# EAGLE design Camera (EAGLE 9.6.2)
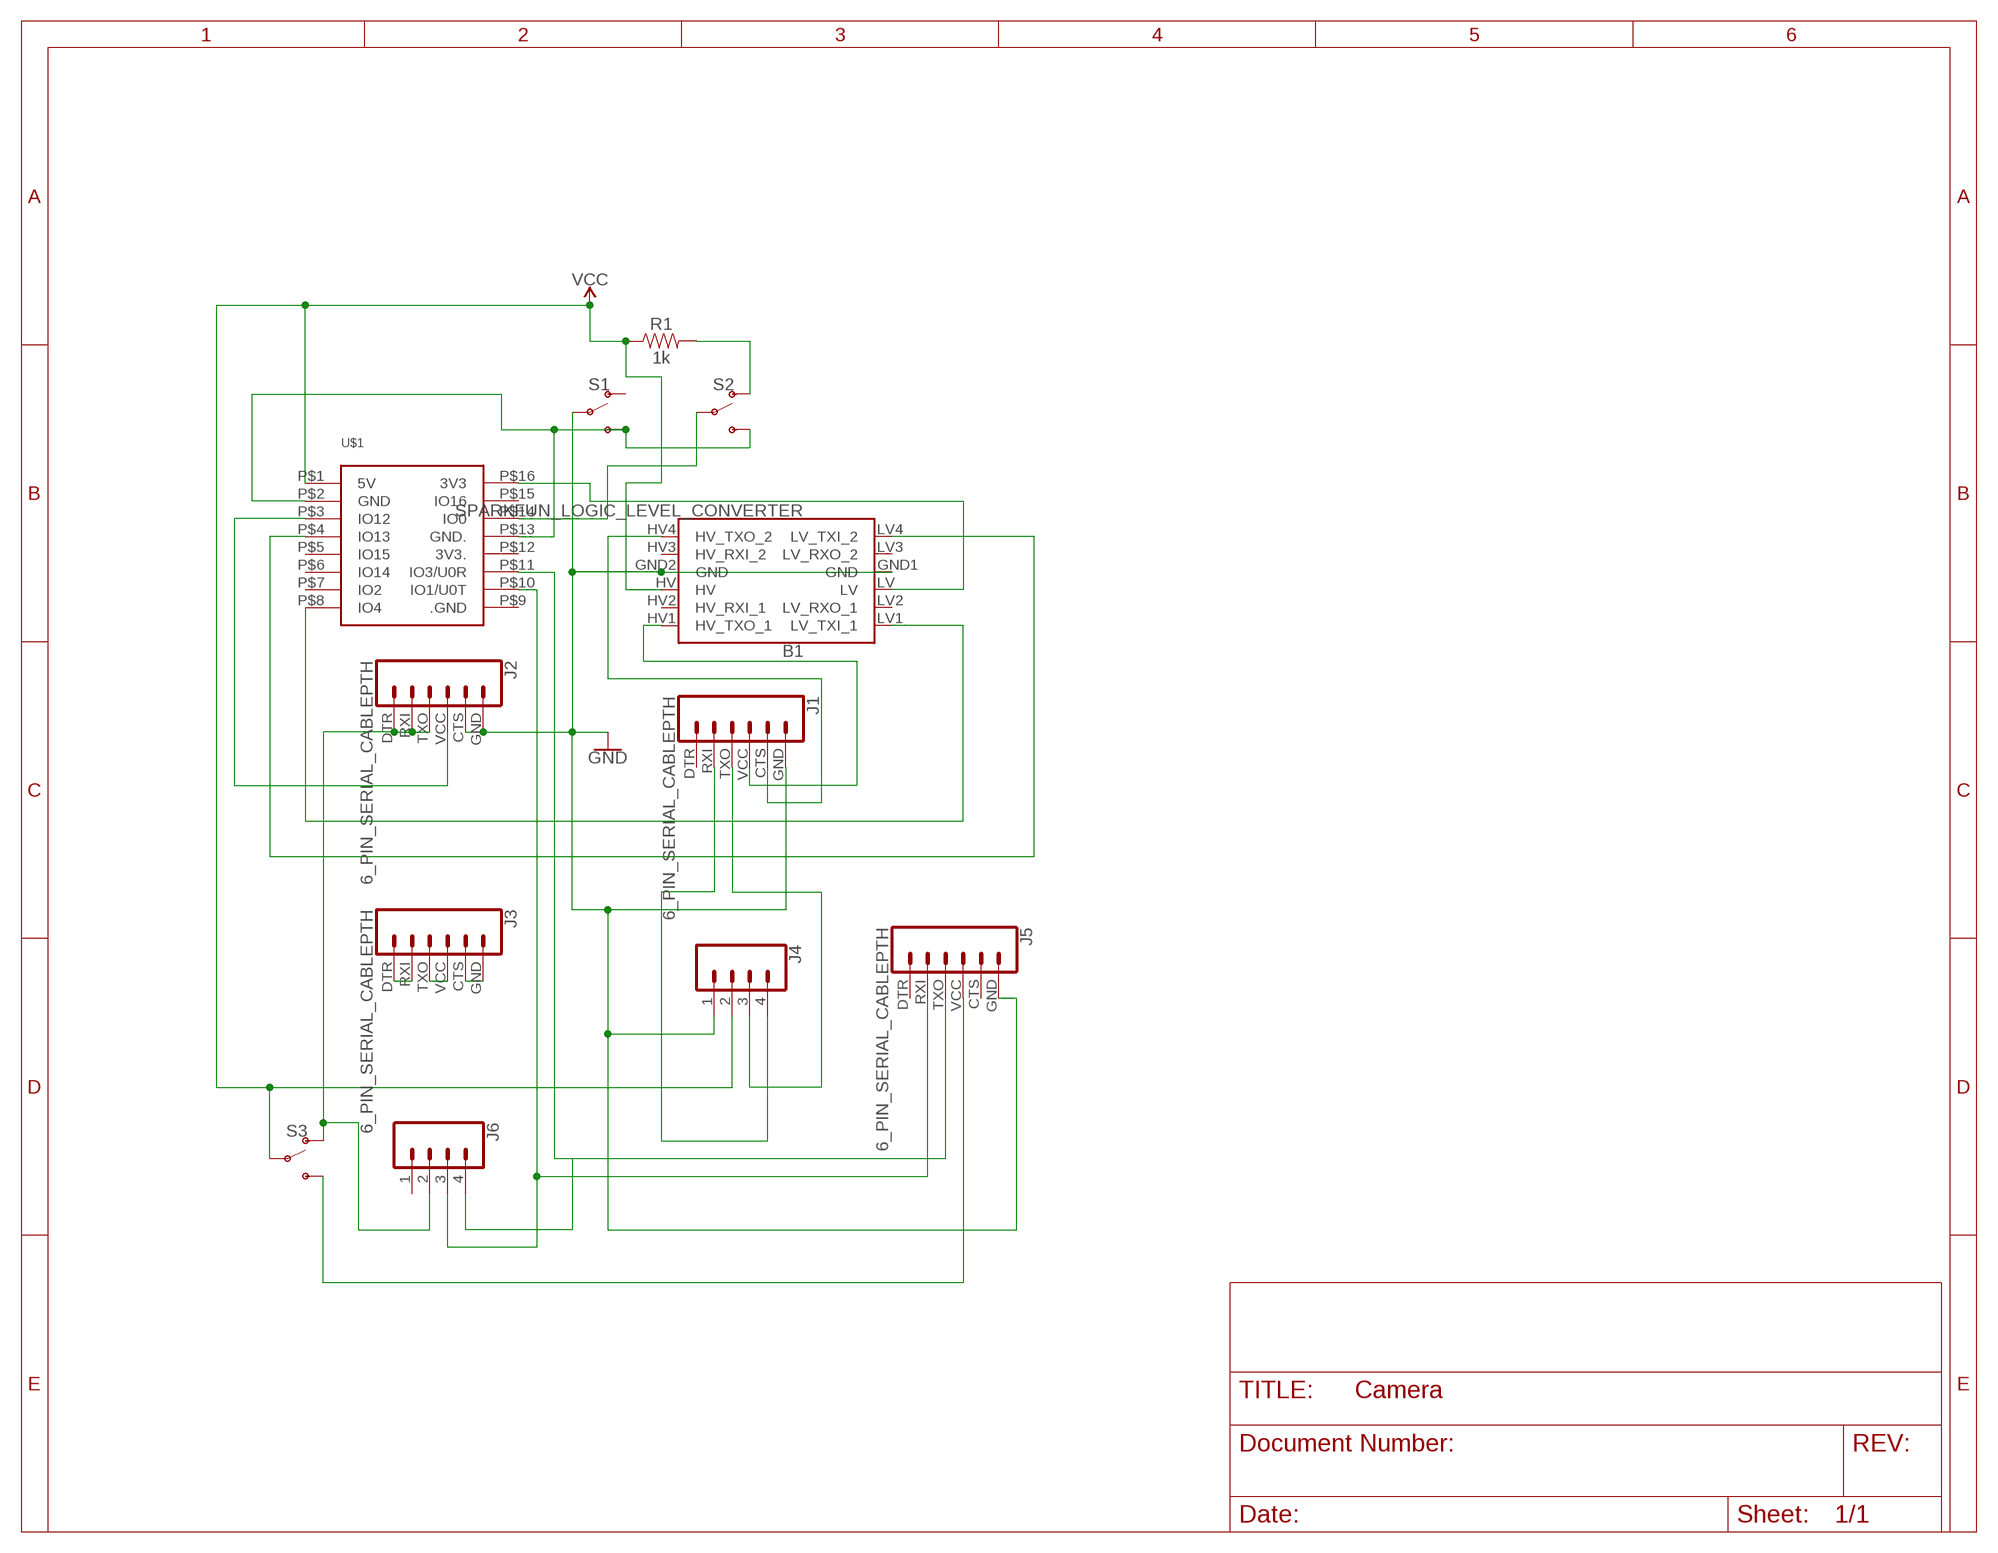
[diagram p0: schematic, sheet 1]

## Parts
B1  SPARKFUN_LOGIC_LEVEL_CONVERTER  [SPARKFUN_LOGIC_LEVEL_CONVERTER]
J1  6_PIN_SERIAL_CABLEPTH  [FTDI_BASIC]
J2  6_PIN_SERIAL_CABLEPTH  [FTDI_BASIC]
J3  6_PIN_SERIAL_CABLEPTH  [FTDI_BASIC]
J4  CONN_04PTH  [1X04]
J5  6_PIN_SERIAL_CABLEPTH  [FTDI_BASIC]
J6  CONN_04PTH  [1X04]
R1  1k  1KOHM-HORIZ_KIT-1/4W-1%  [AXIAL-0.3-KIT]
S1  SWITCH-SPDT-PTH-11.6X4.0MM  [SWITCH_SPDT_PTH_11.6X4.0MM]
S2  SWITCH-SPDT-PTH-11.6X4.0MM  [SWITCH_SPDT_PTH_11.6X4.0MM]
S3  SWITCH-SPDT-PTH-11.6X4.0MM  [SWITCH_SPDT_PTH_11.6X4.0MM]
U$1  ESP32-CAM  [ESP32-CAM]

## Nets
GND: B1.GND1(GND) B1.GND2(GND) J1.GND J2.CTS J2.GND J4.1 J5.GND S1.2(P)
N$1: R1.P$2 S2.1(O)
N$2: S1.3(S) S2.3(S) U$1.P$2(GND) U$1.P$13(GND.)
N$3: J3.DTR J3.RXI
N$4: S2.2(P) U$1.P$14(IO0)
N$5: J3.TXO J3.VCC
N$6: B1.LV1(LV_TXI_1) U$1.P$8(IO4)
N$7: B1.LV4(LV_TXI_2) U$1.P$4(IO13)
N$8: J3.CTS J3.GND
N$9: J2.VCC U$1.P$3(IO12)
N$10: B1.HV1(HV_TXO_1) J1.VCC
N$11: B1.HV4(HV_TXO_2) J1.CTS
N$12: J1.RXI J4.4
N$13: J1.TXO J4.3
N$14: B1.LV U$1.P$16(3V3)
N$15: J5.TXO J6.4 U$1.P$11(IO3/U0R)
N$16: J5.RXI J6.3 U$1.P$10(IO1/U0T)
N$17: J2.DTR J2.RXI J2.TXO J6.2 S3.1(O)
N$18: J5.VCC S3.3(S)
VCC: B1.HV J4.2 R1.P$1 S3.2(P) U$1.P$1(5V)
Unconnected: B1.HV2(HV_RXI_1) B1.HV3(HV_RXI_2) B1.LV2(LV_RXO_1) B1.LV3(LV_RXO_2) J1.DTR J5.CTS J5.DTR J6.1 S1.1(O) U$1.P$5(IO15) U$1.P$6(IO14) U$1.P$7(IO2) U$1.P$9(.GND) U$1.P$12(3V3.) U$1.P$15(IO16)

## Library data of the parts
B1 = SparkFun-Boards:SPARKFUN_LOGIC_LEVEL_CONVERTER: SparkFun Logic Level Converter -Bi-Directional This is the mechnical outline for the 3.3V - 5V bi directional logic level converter. *Note, the "LOCK" Package has the header pins staggered by an offset of 5 mils (off center line), so that when you slide a row of standard 0.1" headers into the PTH pads, it will hold position vertically. See the follwing turorial for more information on this type of special footprints: Sneaky Footprints <https://www.sparkfun.com/tutorials/114> SparkFun Products: SparkFun Logic Level Converter - Bi-Directional <https://www.sparkfun.com/products/12009>
J1-J3 J5 = SparkFun-Connectors:6_PIN_SERIAL_CABLE: 6-pin header connection for use with the "FTDI BASIC" pinout - CABLE SIDE. Also known as "Arduino Serial Program Header". This is used on a design to provide a 6-pin connection point for serial communication usually from a USB cable (D+/D-) to these headers (RX/TX). It also has the remaining pins necessary for programming in the Arduino evironment (DTR, GND, and sometimes VCC). Note, this device has "CABLE" in the name. It is intended to be used on a design that usually lives on the end of your USB cable and prvides the converter chip (FTDI232 or FTDI231x) to commnicate serial RX/TX. The "sister" device, named "TARGET" is inteneded to be used on a design that contains a target micro-controller that you wish to program. You can populate with some of these: Female Headers <https://www.sparkfun.com/products/115> (PRT-00115) For reference (or to suit your programming needs) check out these designs: SparkFun FTDI Basic Breakout - 5V <https://www.sparkfun.com/products/9716> (DEV-09716) SparkFun FTDI Basic Breakout - 3.3V <https://www.sparkfun.com/products/9873> (DEV-09873) SparkFun FTDI SmartBasic <https://www.sparkfun.com/products/12935> (DEV-12935) SparkFun Beefy 3 - FTDI Basic Breakout <https://www.sparkfun.com/products/13746> (DEV-13746)
J4 J6 = SparkFun-Connectors:CONN_04: Multi connection point. Often used as Generic Header-pin footprint for 0.1 inch spaced/style header connections On any of the 0.1 inch spaced packages, you can populate with these: Break Away Headers - Straight <https://www.sparkfun.com/products/116> (PRT-00116) Break Away Male Headers - Right Angle <https://www.sparkfun.com/products/553> (PRT-00553) Female Headers <https://www.sparkfun.com/products/115> (PRT-00115) Break Away Headers - Machine Pin <https://www.sparkfun.com/products/117> (PRT-00117) Break Away Female Headers - Swiss Machine Pin <https://www.sparkfun.com/products/743> (PRT-00743) For SCREWTERMINALS and SPRING TERMINALS visit here: Screw Terimnals on SparkFun.com <https://www.sparkfun.com/search/results?term=Screw+Terminals> (5mm/3.5mm/2.54mm spacing) This device is also useful as a general connection point to wire up your design to another part of your project. Our various solder wires solder well into these plated through hole pads. Hook-Up Wire - Assortment (Stranded, 22 AWG) <https://www.sparkfun.com/products/11375> (PRT-11375) Hook-Up Wire - Assortment (Solid Core, 22 AWG) <https://www.sparkfun.com/products/11367> (PRT-11367) View the entire wire category on our website here <https://www.sparkfun.com/categories/141> Special notes: Molex polarized connector foot print use with SKU : PRT-08231 with associated crimp pins and housings. 1MM SMD Version SKU: PRT-10208; PROD_ID: CONN-09696
R1 = SparkFun-Resistors:1KOHM: 1kΩ resistor A resistor is a passive two-terminal electrical component that implements electrical resistance as a circuit element. Resistors act to reduce current flow, and, at the same time, act to lower voltage levels within circuits. - Wikipedia; PROD_ID: RES-12182
S1-S3 = SparkFun-Switches:SWITCH-SPDT: Single Pole, Double Throw (SPDT) Switch Single-pole, double-throw (SPDT) switch. Variant Overview SMD-AYZ0202 Surface Mount DPDT Switch <https://www.sparkfun.com/products/597> (COM-00597) Used on e.g. LilyPad Arduino USB - ATmega32U4 Board <https://www.sparkfun.com/products/12049> PTH-11.6X4.0MM SPDT Mini Power Switch <https://www.sparkfun.com/products/102> (COM-00102) Used on e.g. SparkFun Simon Says - Through-Hole Soldering Kit <https://www.sparkfun.com/products/10547> (KIT-10547) PTH-11.6X4.0MM-KIT KIT version of SPDT Mini Power Switch - Simplifies soldering by removing tStop of switch pins - only one side can be soldered. PTH-11.6X4.0MM-LOCK LOCK version of SPDT Mini Power Switch - Offset pins hold switch in place for easier soldering. SMD-RIGHT-ANGLE Surface Mount Right Angle Switch <https://www.sparkfun.com/products/10860> (COM-10860) Used on e.g. SparkFun ESP8266 Thing <https://www.sparkfun.com/products/13231>; PROD_ID: SWCH-08261; SF_SKU: COM-00102
U$1 = ESP32-CAM:ESP32-CAM: Check availability <https://pricing.snapeda.com/parts/ESP32-CAM/AI-Thinker/view-part?ref=eda>; AVAILABILITY: Not in stock; DESCRIPTION: ESP32 ESP32 Transceiver; 802.11 a/b/g/n (Wi-Fi, WiFi, WLAN), Bluetooth® Smart 4.x Low Energy (BLE) Evaluation Board; MF: AI-Thinker; MP: ESP32-CAM; PACKAGE: None; PRICE: None

## Board
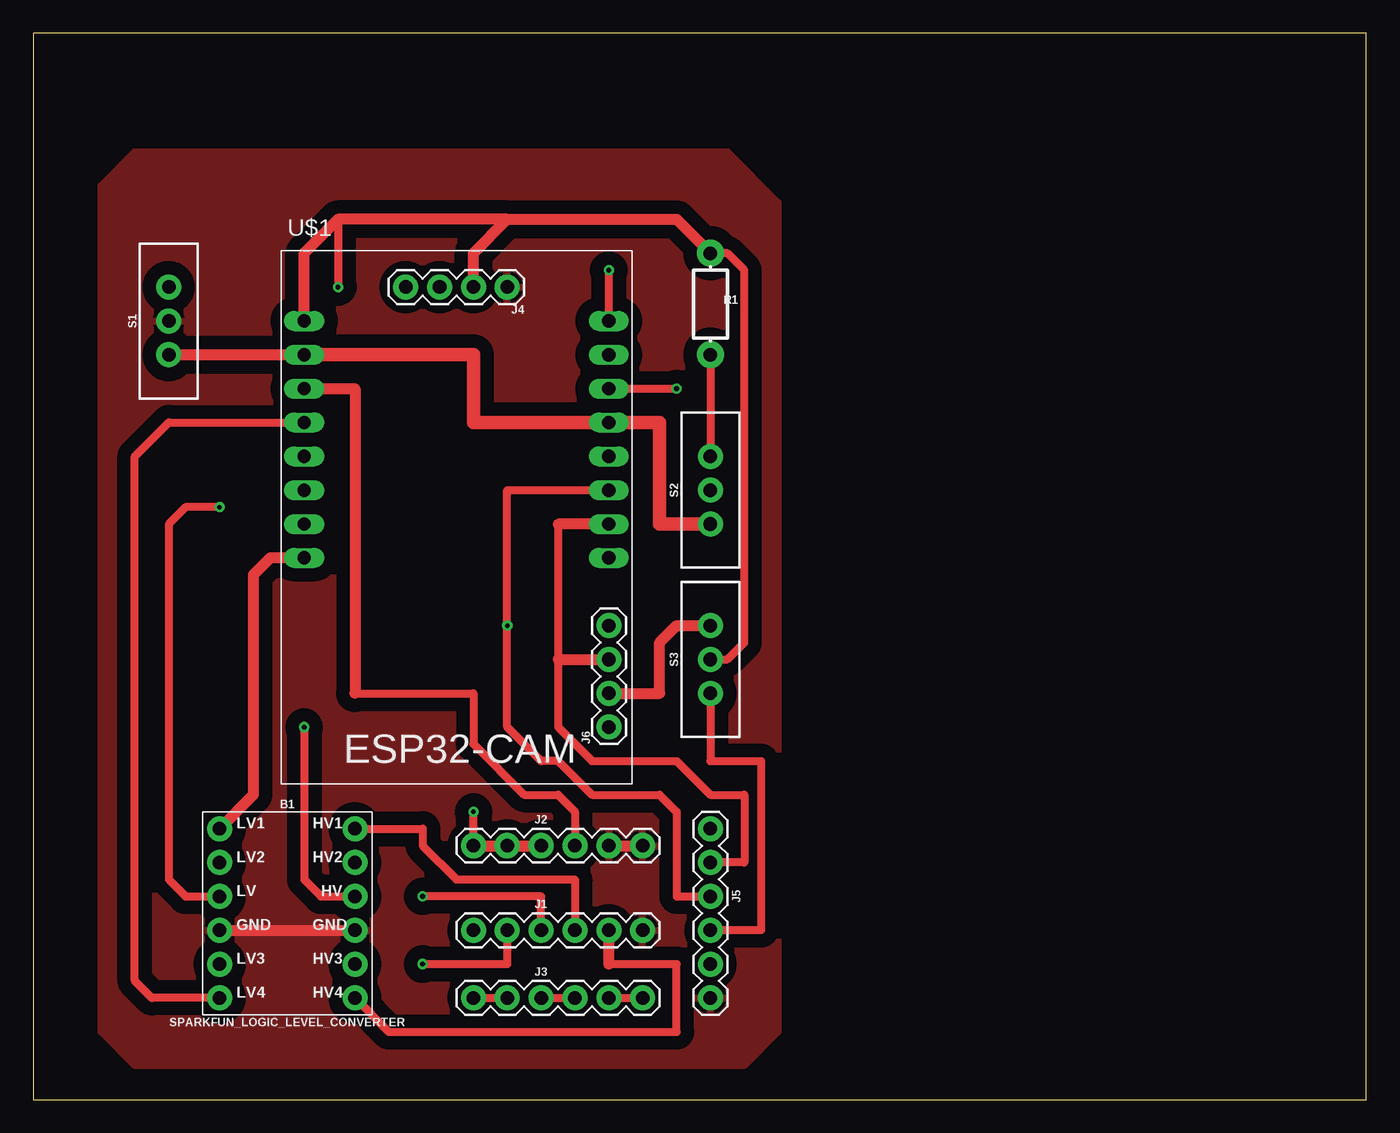
[diagram p1: board, top side]
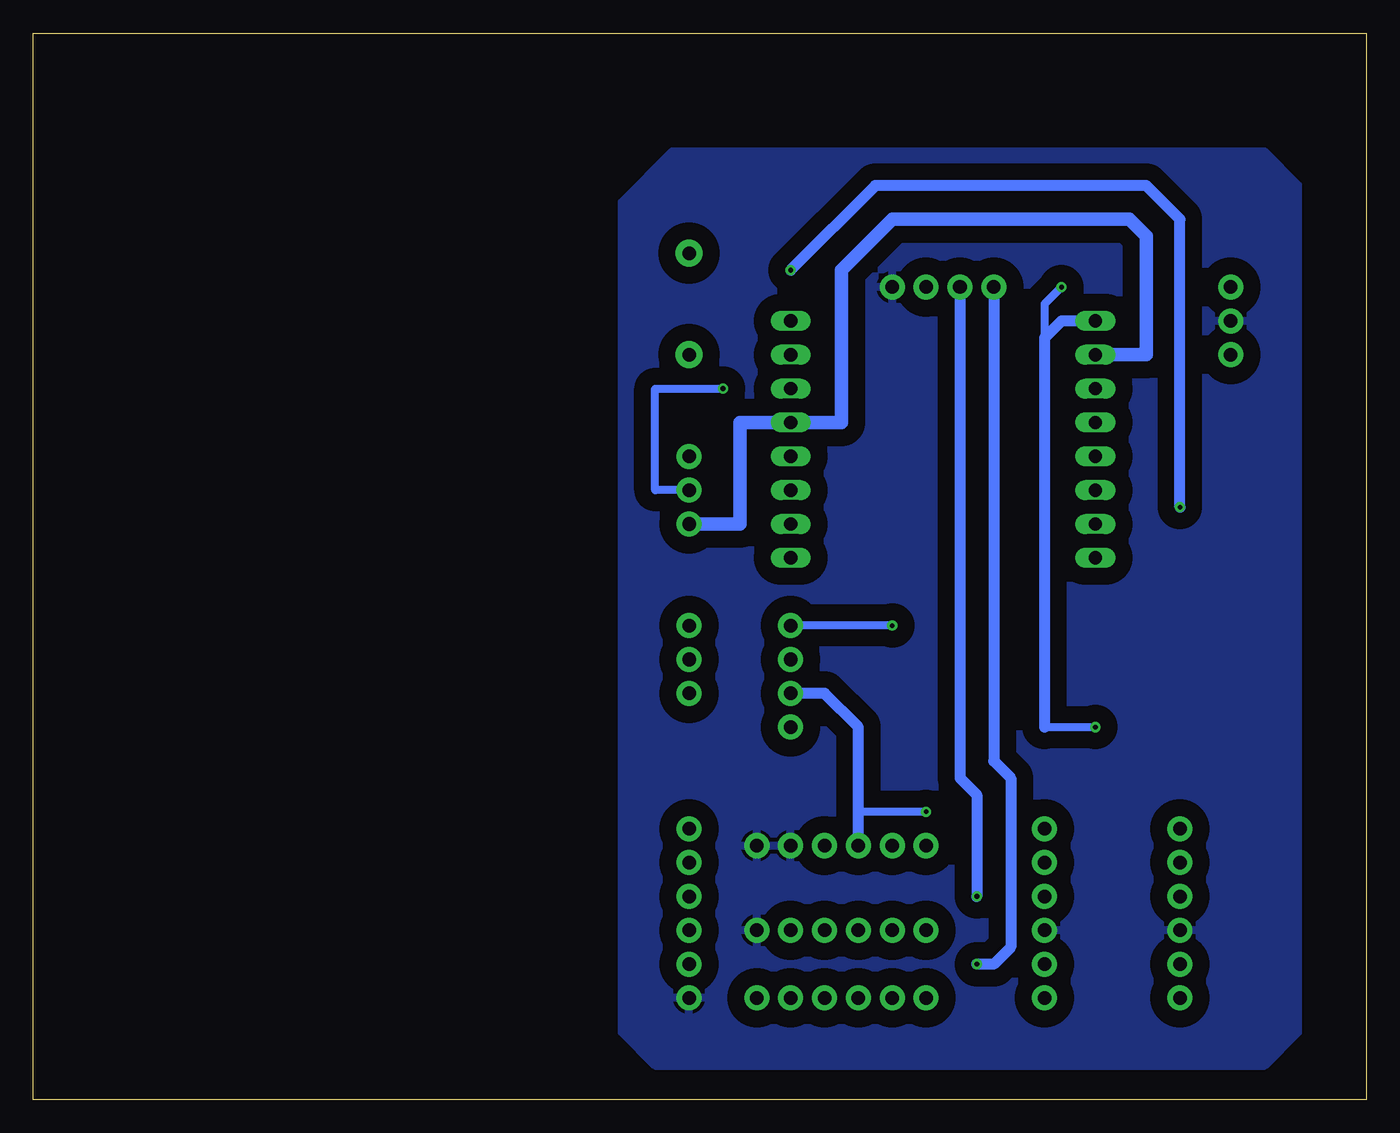
[diagram p2: board, bottom side, seen from below]

Size 100 x 80 mm. Coordinates in mm from the lower left corner, seen from the top.
Outline: 0,0 100,0 100,80 0,80 0,0
Copper layers (1*16): Top 0.035mm / dielectric 1.5mm / Bottom 0.035mm
Design rules "default": minimum track width 6mil, minimum drill 0.35mm, track to track 6mil, track to pad 6mil, pad to pad 6mil, via to via 6mil, smd to smd 6mil, copper to edge 40mil, drill to drill 6mil, minimum pad ring 10mil, minimum via ring 8mil, stop-mask expansion 4mil, vias tented up to drill 0mil, thermal gap 10mil

### Footprints (pad centres in the part's own frame; a part is rotated, then mirrored left to right if it is on the bottom)
SPARKFUN_LOGIC_LEVEL_CONVERTER = drill 1.016 pad 1.88: GND1 -5.08,-1.27; GND2 5.08,-1.27; HV 5.08,1.27; HV1 5.08,6.35; HV2 5.08,3.81; HV3 5.08,-3.81; HV4 5.08,-6.35; LV -5.08,1.27; LV1 -5.08,6.35; LV2 -5.08,3.81; LV3 -5.08,-3.81; LV4 -5.08,-6.35
FTDI_BASIC = drill 1.016 pad 1.88: CTS 10.16,0; DTR 0,0; GND 12.7,0; RXI 2.54,0; TXO 5.08,0; VCC 7.62,0
1X04 = drill 1.016 pad 1.88: 1 0,0; 2 2.54,0; 3 5.08,0; 4 7.62,0
AXIAL-0.3-KIT = drill 1.016 pad 2.032: P$1 -3.81,0; P$2 3.81,0
SWITCH_SPDT_PTH_11.6X4.0MM = drill 1.016 pad 1.88: 1 0,2.54; 2 0,0; 3 0,-2.54
ESP32-CAM = drill 1 pad 1.422 long: P$1 -11.43,10.16; P$2 -11.43,7.62; P$3 -11.43,5.08; P$4 -11.43,2.54; P$5 -11.43,0; P$6 -11.43,-2.54; P$7 -11.43,-5.08; P$8 -11.43,-7.62; P$9 11.43,-7.62; P$10 11.43,-5.08; P$11 11.43,-2.54; P$12 11.43,0; P$13 11.43,2.54; P$14 11.43,5.08; P$15 11.43,7.62; P$16 11.43,10.16

### Placement (x,y rotation side)
B1  19.05,13.97 0 top
J1  33.02,12.7 0 top
J2  33.02,19.05 0 top
J3  33.02,7.62 0 top
J4  35.56,60.96 180 top
J5  50.8,20.32 270 top
J6  43.18,27.94 90 top
R1  50.8,59.69 270 top
S1  10.16,58.42 0 top
S2  50.8,45.72 0 top
S3  50.8,33.02 0 top
U$1  31.75,48.26 0 top

### Tracks (layer width: path | path; a pad name or v marks a point on that pad's centre or on a via)
GND
  Top 0.813: B1.GND1 B1.GND2 | J2.CTS J2.GND
  pour Top (isolate 1.016): 7.62,71.12 52.07,71.12 55.88,67.31 55.88,5.08 53.34,2.54 52.07,2.54 7.62,2.54 5.08,5.08 5.08,68.58
  pour Bottom (isolate 1.27): 5.08,68.58 7.62,71.12 52.07,71.12 55.88,67.31 55.88,5.08 53.34,2.54 7.62,2.54 5.08,5.08
N$1
  Top 0.61: R1.P$2 S2.1
N$2
  Top 0.813: S1.3 U$1.P$2
  Top 1.016: U$1.P$2 33.02,55.88 33.02,50.8 U$1.P$13 46.99,50.8 46.99,43.18 S2.3
  Bottom 1.016: U$1.P$2 16.51,55.88 16.51,64.77 17.78,66.04 35.56,66.04 39.37,62.23 39.37,50.8 U$1.P$13 46.99,50.8 46.99,43.18 S2.3
N$3
  Top 0.61: J3.DTR J3.RXI
N$4  (via drill 0.35)
  Top 0.61: U$1.P$14 v48.26,53.34
  Bottom 0.61: S2.2 53.34,45.72 53.34,53.34 v48.26,53.34
N$5
  Top 0.61: J3.TXO J3.VCC
N$6
  Top 0.813: U$1.P$8 17.78,40.64 16.51,39.37 16.51,22.86 B1.LV1
N$7
  Top 0.61: B1.LV4 8.89,7.62 7.62,8.89 7.62,48.26 10.16,50.8 U$1.P$4
N$8
  Top 0.61: J3.CTS J3.GND
N$9
  Top 0.61: J2.VCC 40.64,21.59 39.37,22.86 36.83,22.86 33.02,26.67 33.02,30.48 24.13,30.48
  Top 0.813: U$1.P$3 24.13,53.34 24.13,30.48
N$10
  Top 0.61: B1.HV1 29.21,20.32 29.21,19.05 31.75,16.51 40.64,16.51 J1.VCC
N$11
  Top 0.61: B1.HV4 26.67,5.08 48.26,5.08 48.26,10.16 43.18,10.16
  Top 0.813: 43.18,10.16 J1.CTS
N$12  (via drill 0.35)
  Top 0.61: J1.RXI 35.56,10.16 v29.21,10.16
  Bottom 0.813: J4.4 27.94,25.4 26.67,24.13 26.67,11.43 27.94,10.16 v29.21,10.16
N$13  (via drill 0.35)
  Top 0.61: J1.TXO 38.1,15.24 v29.21,15.24
  Bottom 0.813: v29.21,15.24 29.21,22.86 30.48,24.13 J4.3
N$14  (via drill 0.35)
  Top 0.61: U$1.P$16 v43.18,62.23 | v13.97,44.45 11.43,44.45 10.16,43.18 10.16,16.51 11.43,15.24 B1.LV
  Bottom 0.813: v43.18,62.23 36.83,68.58 16.51,68.58 13.97,66.04 v13.97,44.45
N$15  (via drill 0.35)
  Top 0.61: J5.TXO 48.26,15.24 48.26,21.59 46.99,22.86 41.91,22.86 39.37,25.4 38.1,25.4 35.56,27.94 v35.56,35.56 35.56,45.72 U$1.P$11
  Bottom 0.61: v35.56,35.56 J6.4
N$16
  Top 0.61: J5.RXI 52.07,17.78 53.34,17.78 53.34,22.86 50.8,22.86 48.26,25.4 41.91,25.4 39.37,27.94 39.37,33.02 39.37,43.18
  Top 0.813: U$1.P$10 39.37,43.18 | 39.37,33.02 J6.3
N$17  (via drill 0.35)
  Top 0.61: J2.TXO J2.RXI J2.DTR v33.02,21.59
  Top 0.813: J2.DTR J2.TXO | J6.2 46.99,30.48 46.99,34.29 48.26,35.56 S3.1
  Bottom 0.61: v33.02,21.59 38.1,21.59
  Bottom 0.813: J6.2 40.64,30.48 38.1,27.94 38.1,21.59 J2.TXO
N$18
  Top 0.61: S3.3 50.8,25.4 54.61,25.4 54.61,12.7 J5.VCC
VCC  (via drill 0.35)
  Top 0.61: S3.2 52.07,33.02 53.34,34.29 53.34,62.23 52.07,63.5 R1.P$1 | 22.86,66.04 v22.86,60.96 | v20.32,27.94 20.32,16.51 21.59,15.24 B1.HV
  Top 0.813: U$1.P$1 20.32,63.5 22.86,66.04 35.56,66.04 | 35.56,66.04 48.26,66.04 R1.P$1 | J4.2 33.02,63.5 35.56,66.04
  Bottom 0.61: v22.86,60.96 24.13,59.69 24.13,57.15 | 24.13,27.94 v20.32,27.94
  Bottom 0.813: U$1.P$1 22.86,58.42 24.13,57.15 24.13,27.94